# Altium project STM32 INC.PrjPcb
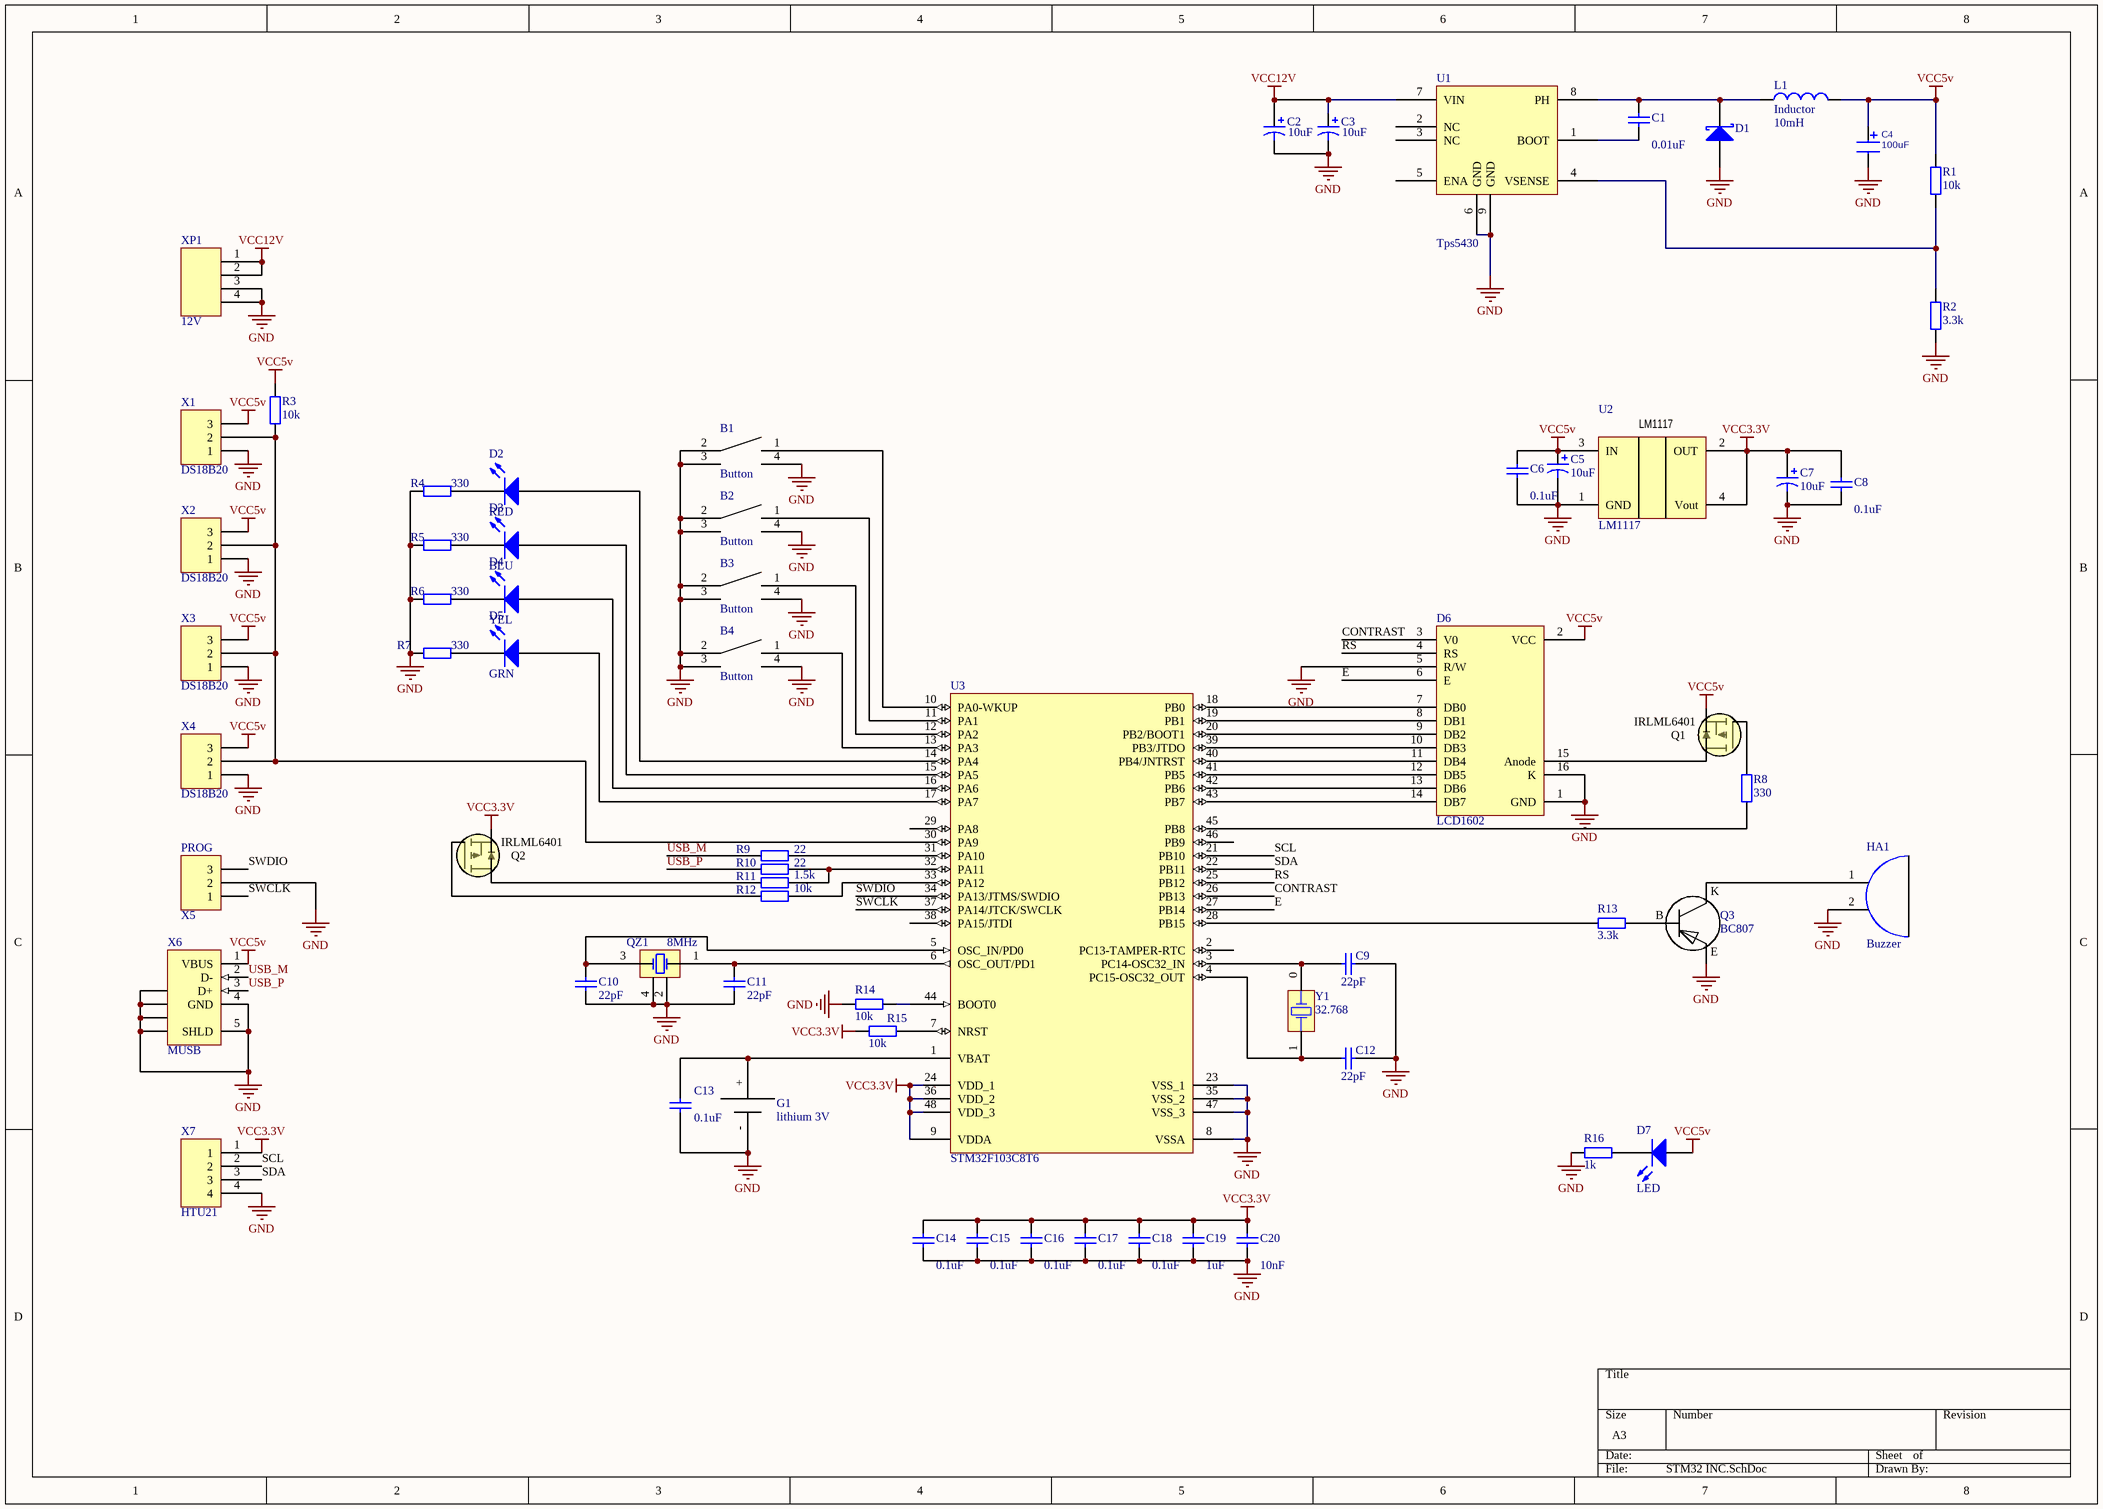
[diagram p0: STM32 INC.SchDoc]
1 sheet, 66 parts. Net scope: global (net labels, ports and power ports of the same name join across sheets).
Board file: STM32 INC.PcbDoc

## Sheet STM32 INC.SchDoc
size A3

### Parts
B1  Button  [Button]
B2  Button  [Button]
B3  Button  [Button]
B4  Button  [Button]
C1  value 0.01uF  [Capacitor 0603]  (hidden comment: Capacitor)
C2  value 10uF  [Capacitor D case]  (hidden comment: Capacitor Polar)
C3  value 10uF  [Capacitor D case]  (hidden comment: Capacitor Polar)
C4  100uF  [Cap 0810]
C5  value 10uF  [Capacitor B case]  (hidden comment: Capacitor Polar)
C6  value 0.1uF  [Capacitor 0603]  (hidden comment: Capacitor)
C7  value 10uF  [Capacitor B case]  (hidden comment: Capacitor Polar)
C8  value 0.1uF  [Capacitor 0603]  (hidden comment: Capacitor)
C9  value 22pF  [Capacitor 0603]  (hidden comment: Capacitor)
C10  value 22pF  [Capacitor 0603]  (hidden comment: Capacitor)
C11  value 22pF  [Capacitor 0603]  (hidden comment: Capacitor)
C12  value 22pF  [Capacitor 0603]  (hidden comment: Capacitor)
C13  value 0.1uF  [Capacitor 0603]  (hidden comment: Capacitor)
C14  value 0.1uF  [Capacitor 0603]  (hidden comment: Capacitor)
C15  value 0.1uF  [Capacitor 0603]  (hidden comment: Capacitor)
C16  value 0.1uF  [Capacitor 0603]  (hidden comment: Capacitor)
C17  value 0.1uF  [Capacitor 0603]  (hidden comment: Capacitor)
C18  value 0.1uF  [Capacitor 0603]  (hidden comment: Capacitor)
C19  value 1uF  [Capacitor 0603]  (hidden comment: Capacitor)
C20  value 10nF  [Capacitor 0603]  (hidden comment: Capacitor)
D1  Diode schottky  [SMC]  (value not drawn)
D2  RED  [LED0805 RED]
D3  BLU  [LEDBLUE 00805]
D4  YEL  [LED0805 YELLOW]
D5  GRN  [LED0805 GREEN]
D6  LCD1602  [LCD1602]
D7  LED  [LED0805 GREEN]
G1  lithium 3V  [Battery li-ion CR2032]
HA1  Buzzer  [Buzzer]
L1  Inductor  value 10mH  [B82477]
Q1  IRLML6401  [SOT23-3_3,0x1,6x0,95]
Q2  IRLML6401  [SOT23-3_3,0x1,6x0,95]
Q3  BC807  [SOT-23]
QZ1  8MHz  [KX – 9A]
R1  value 10k  [RESistor 0603]  (hidden comment: Resistor)
R2  value 3.3k  [RESistor 0603]  (hidden comment: Resistor)
R3  value 10k  [RESistor 0603]  (hidden comment: Resistor)
R4  value 330  [RESistor 0603]  (hidden comment: Resistor)
R5  value 330  [RESistor 0603]  (hidden comment: Resistor)
R6  value 330  [RESistor 0603]  (hidden comment: Resistor)
R7  value 330  [RESistor 0603]  (hidden comment: Resistor)
R8  value 330  [RESistor 0603]  (hidden comment: Resistor)
R9  value 22  [RESistor 0603]  (hidden comment: Resistor)
R10  value 22  [RESistor 0603]  (hidden comment: Resistor)
R11  value 1.5k  [RESistor 0603]  (hidden comment: Resistor)
R12  value 10k  [RESistor 0603]  (hidden comment: Resistor)
R13  value 3.3k  [RESistor 0603]  (hidden comment: Resistor)
R14  value 10k  [RESistor 0603]  (hidden comment: Resistor)
R15  value 10k  [RESistor 0603]  (hidden comment: Resistor)
R16  value 1k  [RESistor 0603]  (hidden comment: Resistor)
U1  Tps5430  [PSOP8]
U2  LM1117  [SOT-223]
U3  STM32F103C8T6  [LQFP48_N]
X1  DS18B20  [PLS-3-3D]
X2  DS18B20  [PLS-3-3D]
X3  DS18B20  [PLS-3-3D]
X4  DS18B20  [PLS-3-3D]
X5  PROG  [PLS-3-2]
X6  MUSB  [UX60-MB]
X7  HTU21  [Header4_254]
XP1  12V  [MF2x4MRA]
Y1  32.768  [x3215]

### Nets
GND: B1.2 B1.3 B1.4 B2.2 B2.3 B2.4 B3.2 B3.3 B3.4 B4.2 B4.3 B4.4 C2.2 C3.2 C4.2 C5.2 C6.1 C7.2 C8.1 C9.1 C10.2 C11.2 C12.1 C13.1 C14.1 C15.1 C16.1 C17.1 C18.1 C19.1 C20.1 D1.2(A) D6.1(GND) D6.5(R/W) D6.16(K) G1.-(GND) HA1.2 Q3.2 QZ1.2(OSC2) QZ1.4(GND) R2.1 R4.2 R5.2 R6.2 R7.2 R14.1 R16.1 U1.6(GND) U1.9(GND) U2.1(GND) U3.8(VSSA) U3.23(VSS_1) U3.35(VSS_2) U3.47(VSS_3) X1.1 X2.1 X3.1 X4.1 X5.2 X6.4(GND) X6.5(SHLD) X6.6(SHLD) X6.7(SHLD) X6.8(SHLD) X6.9(SHLD) X7.4 XP1.3 XP1.4
VCC3.3V: C7.1 C8.2 C14.2 C15.2 C16.2 C17.2 C18.2 C19.2 C20.2 Q2.2 R15.1 U2.2(OUT) U2.4(Vout) U3.9(VDDA) U3.24(VDD_1) U3.36(VDD_2) U3.48(VDD_3) X7.1
VCC5v: C4.1 C5.1 C6.2 D6.2(VCC) D7.1(A) L1.2 Q1.2 R1.2 R3.2 U2.3(IN) X1.3 X2.3 X3.3 X4.3 X6.1(VBUS)
VCC12V: C2.1 C3.1 U1.7(VIN) XP1.1 XP1.2
CONTRAST: D6.3(V0) U3.26(PB13)
E: D6.6(E) U3.27(PB14)
RS: D6.4(RS) U3.25(PB12)
SCL: U3.21(PB10) X7.2
SDA: U3.22(PB11) X7.3
SWCLK: U3.37(PA14/JTCK/SWCLK) X5.1
SWDIO: U3.34(PA13/JTMS/SWDIO) X5.3
USB_M: R9.2 X6.2(D-)
USB_P: R10.2 X6.3(D+)
NetB1_1: B1.1 U3.10(PA0-WKUP)
NetB2_1: B2.1 U3.11(PA1)
NetB3_1: B3.1 U3.12(PA2)
NetB4_1: B4.1 U3.13(PA3)
NetC1_1: C1.1 U1.1(BOOT)
NetC1_2: C1.2 D1.1(K) L1.1 U1.8(PH)
NetC9_2: C9.2 U3.3(PC14-OSC32_IN) Y1.0(OSC1)
NetC10_1: C10.1 QZ1.3(GND) U3.5(OSC_IN/PD0)
NetC11_1: C11.1 QZ1.1(OSC1) U3.6(OSC_OUT/PD1)
NetC12_2: C12.2 U3.4(PC15-OSC32_OUT) Y1.1(OSC2)
NetC13_2: C13.2 G1.+(VBAT) U3.1(VBAT)
NetD2_1: D2.1(A) U3.14(PA4)
NetD2_2: D2.2(K) R4.1
NetD3_1: D3.1(A) U3.15(PA5)
NetD3_2: D3.2(K) R5.1
NetD4_1: D4.1(A) U3.16(PA6)
NetD4_2: D4.2(K) R6.1
NetD5_1: D5.1(A) U3.17(PA7)
NetD5_2: D5.2(K) R7.1
NetD6_7: D6.7(DB0) U3.18(PB0)
NetD6_8: D6.8(DB1) U3.19(PB1)
NetD6_9: D6.9(DB2) U3.20(PB2/BOOT1)
NetD6_10: D6.10(DB3) U3.39(PB3/JTDO)
NetD6_11: D6.11(DB4) U3.40(PB4/JNTRST)
NetD6_12: D6.12(DB5) U3.41(PB5)
NetD6_13: D6.13(DB6) U3.42(PB6)
NetD6_14: D6.14(DB7) U3.43(PB7)
NetD6_15: D6.15(Anode) Q1.3
NetD7_2: D7.2(K) R16.2
NetHA1_1: HA1.1 Q3.3
NetQ1_1: Q1.1 R8.1
NetQ2_1: Q2.1 R12.1
NetQ2_3: Q2.3 R11.1
NetQ3_1: Q3.1 R13.2
NetR1_1: R1.1 R2.2 U1.4(VSENSE)
NetR3_1: R3.1 U3.30(PA9) X1.2 X2.2 X3.2 X4.2
NetR8_2: R8.2 U3.45(PB8)
NetR9_1: R9.1 U3.31(PA10)
NetR10_1: R10.1 R11.2 U3.32(PA11)
NetR12_2: R12.2 U3.33(PA12)
NetR13_1: R13.1 U3.28(PB15)
NetR14_2: R14.2 U3.44(BOOT0)
NetR15_2: R15.2 U3.7(NRST)

Not connected (* = marked no-connect by the designer): U1 2(NC) 3(NC) 5(ENA); U3 2(PC13-TAMPER-RTC) 29(PA8) 38(PA15/JTDI) 46(PB9)

### Notes on the sheet
- (in symbol BC807) K; B; E

### Library data of the parts
C2 C3 C5 C7 = Cap Pol: Polarized Capacitor (Axial); Published: 8-Jun-2000; LatestRevisionDate: 17-Jul-2002; LatestRevisionNote: Re-released for DXP Platform.; PackageReference: POLAR0.8; Publisher: Altium Limited; PackageDescription: Polarized Capacitor; 2 Leads
C4 = CAP0810Alu: Capacitor; Value: 100uF
D1 = Diode schottky: Schottky Rectifier; Note: Terminal 2 is the TAB and is electrically connected to the cathode; Published: 8-Jun-2000; LatestRevisionDate: 17-Jul-2002; LatestRevisionNote: Re-released for DXP Platform.; DatasheetVersion: Dec-1997; PackageVersion: Feb-1998; PackageReference: TO-220AC; Publisher: Altium Limited; PackageDescription: TO, Thru-Hole, Vertical, Heatsink Mounted; 3 In-Line Leads (1 Absent); Pitch 2.54 mm; ComponentLink1Description: Manufacturer Link; ComponentLink1URL: http://www.irf.com/; ComponentLink2Description: Datasheet; ComponentLink2URL: http://www.irf.com/product-info/datasheets/data/18tq.pdf
D2-D5 D7 = LED: Typical INFRARED GaAs LED; Published: 8-Jun-2000; LatestRevisionDate: 08-Jul-2005; LatestRevisionNote: Mech Layer 1 removed.; PackageReference: LED-0; Publisher: Altium Limited; PackageDescription: LED; 2 Leads
L1 = Inductor: Code_IEC: 1005; Published: 8-Jun-2000; LatestRevisionDate: 29-May-2009; LatestRevisionNote: IPC-7351 Footprint Added.; PackageReference: 0402-A; Publisher: Altium Limited; PackageDescription: Chip Inductor; Code_JEITA: 0402
Q1 Q2 = IRLML6401TRPBF: P-MOSFET; ClassName: ChipComponent; Package: 3SOT23
QZ1 = KX-7
U2 = lm1117: Linear regulator
U3 = STM32F103C8T6: STM32 ARM-based 32-bit MCU with 64 Kbytes Flash, 48-pin LQFP, Industrial Temperature; Published: 30-May-2008; DatasheetVersion: rev6, Mar-2008; PackageVersion: Mar-2008; PackageReference: LQFP48; Publisher: Altium Limited; PackageDescription: 48-Pin Low-Profile Quad Flat Pack, 7 x 7 mm Body, 0.5 mm Pitch (LQFP48); ComponentLink1Description: Manufacturer Link; ComponentLink1URL: www.st.com/stm32; ComponentLink2Description: Datasheet; ComponentLink2URL: http://www.st.com/stonline/products/literature/ds/13587.pdf
X1-X4 = PLS-3: Header, 3-Pin; LatestRevisionDate: 17-Jul-2002; LatestRevisionNote: Re-released for DXP Platform.; Publisher: Altium Limited
X5 = PLS2-3: Header, 3-Pin; LatestRevisionDate: 17-Jul-2002; LatestRevisionNote: Re-released for DXP Platform.; Publisher: Altium Limited
X6 = USB_Mini: mini USB; ContactMaterial: Copper Alloy; ContactPlating: Gold (30); PCB_Layout: Complies with manufacturer's recommendation.; DrillSize: Corresponds to nominal value.; PanelGround: Without; Published: 15-Jul-2004; DatasheetDocument: 27-Jun-2003; PackageDocument: 27-Jun-2003; PackageReference: 440247; Publisher: Altium Limited; HousingMaterial: Thermoplastic; ComponentLink1Description: Manufacturer Link; ComponentLink1URL: http://www.tycoelectronics.com/; ComponentLink2Description: Packaging Specification; ComponentLink2URL: http://ecommas.tycoelectronics.com/commerce/DocumentDelivery/DDEController?Action=showdoc&DocId=Customer+Drawing%7F440247%7FD%7Fpdf%7FEnglish%7FC_440247_D.pdf
X7 = Header4_2.54.AMP  5-103673-3
XP1 = MF2x2MRA: Type: Connector
Y1 = Y_3215: Crystal Oscillator; Value: 32.768